# EAGLE board eTapper1main32 (EAGLE 8.3.2)
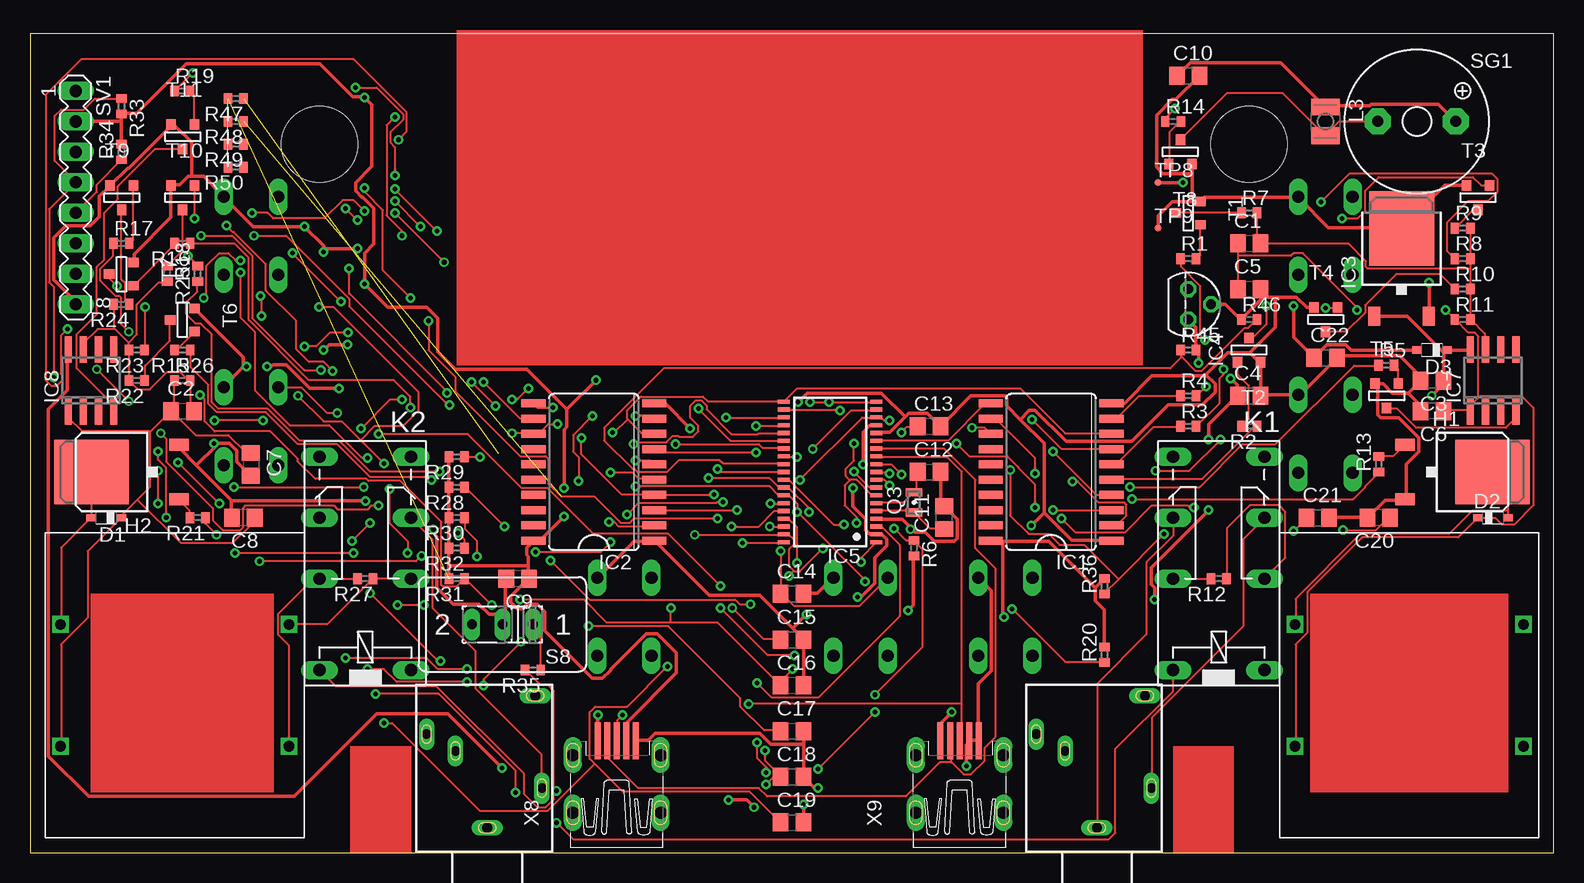
[diagram p1: board, top side]
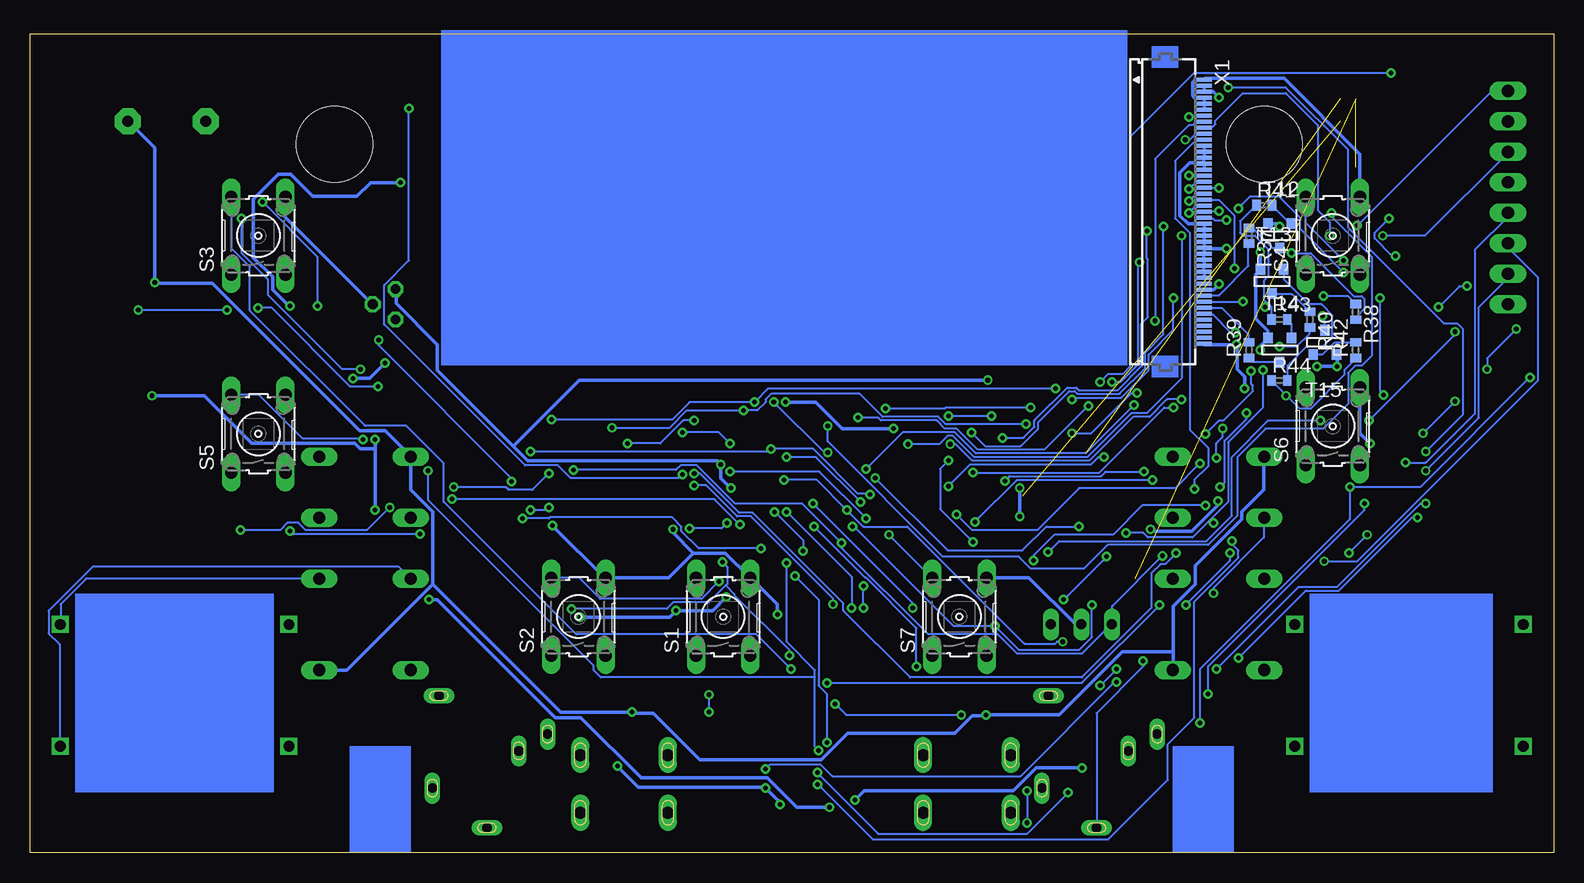
[diagram p2: board, bottom side, seen from below]

Size 126.98 x 68.25 mm. Coordinates in mm from the lower left corner, seen from the top.
Outline: 0,0 126.98,0 126.98,68.25 0,68.25 0,0
Copper layers (1*16): Top 0.035mm / dielectric 1.5mm / Bottom 0.035mm
Design rules "default *": minimum track width 6mil, minimum drill 15mil, track to track 6mil, track to pad 6mil, pad to pad 6mil, via to via 6mil, smd to smd 6mil, copper to edge 40mil, drill to drill 6mil, minimum pad ring 10mil, minimum via ring 8mil, stop-mask expansion 4mil, vias tented up to drill 0mil, thermal gap 10mil
Net classes: 1 GND: width 0.305 mm, clearance 0.152 mm; 2 BAT+: width 0.305 mm, clearance 0.152 mm; 3 +9V: width 0.305 mm, clearance 0.152 mm; 4 +3V: width 0.305 mm, clearance 0.152 mm; 5 VCC: width 0.305 mm, clearance 0.152 mm
Holes 6.35 mm at 24.13,59.05 101.6,59.05

## Footprints (pad centres in the part's own frame; a part is rotated, then mirrored left to right if it is on the bottom)
C0805 = smd 1.3 x 1.5: 1 -0.95,0; 2 0.95,0
SOD323_ST = smd 0.8 x 0.6: A 1.25,0; C -1.25,0
XFMR = drill 0.889 square: P$1 -10.16,5.08; P$2 -10.16,-5.08; P$3 8.89,5.08; P$4 8.89,-5.08
D-PAK_TO252AA = smd 1 x 1.6: 1 -2.28,-4.8; 3 2.28,-4.8 | smd 5.4 x 6.2: 4 0,2.5
SO20W = smd 0.66 x 2.032: 1 -5.715,-5.029; 2 -4.445,-5.029; 3 -3.175,-5.029; 4 -1.905,-5.029; 5 -0.635,-5.029; 6 0.635,-5.029; 7 1.905,-5.029; 8 3.175,-5.029; 9 4.445,-5.029; 10 5.715,-5.029; 11 5.715,5.029; 12 4.445,5.029; 13 3.175,5.029; 14 1.905,5.029; 15 0.635,5.029; 16 -0.635,5.029; 17 -1.905,5.029; 18 -3.175,5.029; 19 -4.445,5.029; 20 -5.715,5.029
TO252 = smd 1 x 1.6: 1 -2.28,-4.8; 3 2.28,-4.8 | smd 5.4 x 6.2: 2 0,2.5
TO92 = drill 0.813 pad 1.27 octagon: 1 -1.27,0; 2 0,1.905; 3 1.27,0
TSSOP38_R-PDSO-G38-DA = smd 0.35 x 1: 1 -5.85,-3.85; 2 -5.2,-3.85; 3 -4.55,-3.85; 4 -3.9,-3.85; 5 -3.25,-3.85; 6 -2.6,-3.85; 7 -1.95,-3.85; 8 -1.3,-3.85; 9 -0.65,-3.85; 10 0,-3.85; 11 0.65,-3.85; 12 1.3,-3.85; 13 1.95,-3.85; 14 2.6,-3.85; 15 3.25,-3.85; 16 3.9,-3.85; 17 4.55,-3.85; 18 5.2,-3.85; 19 5.85,-3.85; 20 5.85,3.85; 21 5.2,3.85; 22 4.55,3.85; 23 3.9,3.85; 24 3.25,3.85; 25 2.6,3.85; 26 1.95,3.85; 27 1.3,3.85; 28 0.65,3.85; 29 0,3.85; 30 -0.65,3.85; 31 -1.3,3.85; 32 -1.95,3.85; 33 -2.6,3.85; 34 -3.25,3.85; 35 -3.9,3.85; 36 -4.55,3.85; 37 -5.2,3.85; 38 -5.85,3.85
SO08 = smd 0.6 x 2.2: 1 -1.905,-2.6; 2 -0.635,-2.6; 3 0.635,-2.6; 4 1.905,-2.6; 5 1.905,2.6; 6 0.635,2.6; 7 -0.635,2.6; 8 -1.905,2.6
351 = drill 1.016 long: 1 -3.81,-3.81; 16 -3.81,3.81; O1 8.89,-3.81; O2 8.89,3.81; P1 3.81,-3.81; P2 3.81,3.81; S1 13.97,-3.81; S2 13.97,3.81
L2825P = smd 1.4 x 2.4: 1 -1.2,0; 2 1.2,0
FC-12M = smd 0.7 x 1.4: 1 -0.85,0; 2 0.85,0
R0402 = smd 0.7 x 0.9: 1 -0.65,0; 2 0.65,0
B3F-10XX = drill 1.016 long: 1 -3.251,2.261; 2 3.251,2.261; 3 -3.251,-2.261; 4 3.251,-2.261
M251 = drill 0.813 long: 1 -2.54,0; 2 0,0; 3 2.54,0
F/QMBIII = drill 0.914 pad 2.159 octagon: + 3.251,0; - -3.251,0
MA08-1 = drill 1.016 long: 1 -8.89,0; 2 -6.35,0; 3 -3.81,0; 4 -1.27,0; 5 1.27,0; 6 3.81,0; 7 6.35,0; 8 8.89,0
SOT-23 = smd 0.787 x 0.889: 1 0.025,-1.016; 2 -0.94,1.016; 3 0.991,1.016
TP06R = smd 0.6 x 0.6: TP 0,0
FH12-45S-0.5SH = smd 0.3 x 1.3: 1 -13,3.25; 2 -12.5,3.25; 3 -12,3.25; 4 -11.5,3.25; 5 -11,3.25; 6 -10.5,3.25; 7 -10,3.25; 8 -9.5,3.25; 9 -9,3.25; 10 -8.5,3.25; 11 -8,3.25; 12 -7.5,3.25; 13 -7,3.25; 14 -6.5,3.25; 15 -6,3.25; 16 -5.5,3.25; 17 -5,3.25; 18 -4.5,3.25; 19 -4,3.25; 20 -3.5,3.25; 21 -3,3.25; 22 -2.5,3.25; 23 -2,3.25; 24 -1.5,3.25; 25 -1,3.25; 26 -0.5,3.25; 27 0,3.25; 28 0.5,3.25; 29 1,3.25; 30 1.5,3.25; 31 2,3.25; 32 2.5,3.25; 33 3,3.25; 34 3.5,3.25; 35 4,3.25; 36 4.5,3.25; 37 5,3.25; 38 5.5,3.25; 39 6,3.25; 40 6.5,3.25; 41 7,3.25; 42 7.5,3.25; 43 8,3.25; 44 8.5,3.25; 45 9,3.25
1503_09 = drill 0.8 pad 1.2 long: 1 0,-2.1; 2 -4.55,-5.4; 3 5.05,-9.9; 4 -4,-13.1; 5 2.65,-8.5
32005-501 = smd 3.1 x 0.5: 1 3,1.6; 2 3,0.8; 3 3,0; 4 3,-0.8; 5 3,-1.6 | drill 1 pad 1.422 long: M1 -3,3.65; M2 -3,-3.65; M3 1.8,3.65; M4 1.8,-3.65

## Placement (x,y rotation side)
C1  .01uF  [C0805]  101.6,50.8 0 top
C2  .01uF  [C0805]  12.7,36.83 0 top
C3  [C0805]  116.84,39.37 180 top
C4  [C0805]  101.6,38.1 0 top
C5  3.3uF  [C0805]  101.6,46.99 0 top
C6  220uF  [C0805]  116.84,36.83 180 top
C7  220uF  [C0805]  18.41,32.38 270 top
C8  3.3uF  [C0805]  17.78,27.94 180 top
C9  47uF  [C0805]  40.64,22.86 180 top
C10  47uF  [C0805]  96.52,64.77 0 top
C11  12pF  [C0805]  76.2,27.94 90 top
C12  12pF  [C0805]  74.93,31.75 0 top
C13  1 uF  [C0805]  74.93,35.56 0 top
C14  .1uF  [C0805]  63.5,21.59 0 top
C15  .1uF  [C0805]  63.5,17.78 0 top
C16  .1uF  [C0805]  63.5,13.97 0 top
C17  .1uF  [C0805]  63.5,10.16 0 top
C18  .1uF  [C0805]  63.5,6.35 0 top
C19  .1uF  [C0805]  63.5,2.54 0 top
C20  .1uF  [C0805]  112.39,27.94 180 top
C21  .1uF  [C0805]  107.31,27.94 0 top
C22  220uF  [C0805]  107.95,41.27 0 top
D1  BAT60J  [SOD323_ST]  6.35,27.94 180 top
D2  BAT60J  [SOD323_ST]  121.92,27.94 0 top
D3  BAT60J  [SOD323_ST]  116.84,41.91 180 top
F1  XFMR  [XFMR]  115.57,13.97 0 top
F2  XFMR  [XFMR]  12.7,13.97 0 top
H1  IRLR024N  [D-PAK_TO252AA]  119.38,31.75 270 top
H2  IRLR024N  [D-PAK_TO252AA]  7.62,31.75 90 top
IC1  74AC373DW  [SO20W]  85.09,31.75 90 top
IC2  74AC373DW  [SO20W]  46.99,31.75 90 top
IC3  LM2936DT-5.0  [TO252]  114.3,49.53 0 top
IC4  LM2936Z-3.0  [TO92]  96.52,45.72 270 top
IC5  MSP430F2232IDA  [TSSOP38_R-PDSO-G38-DA]  66.67,31.75 90 top
IC7  LP2951M  [SO08]  121.92,39.37 0 top
IC8  LP2951M  [SO08]  5.08,39.37 0 top
K1  351  [351]  99.06,19.05 90 top
K2  351  [351]  27.94,19.05 90 top
L3  470uH  [L2825P]  107.95,60.96 270 top
Q3  FC-12M  [FC-12M]  73.66,29.21 90 top
R1  47K  [R0402]  96.52,49.53 0 top
R2  47K  [R0402]  101.6,35.56 180 top
R3  47K  [R0402]  96.52,35.56 0 top
R4  47K  [R0402]  96.52,38.1 0 top
R5  47K  [R0402]  113.03,40.64 0 top
R6  47K  [R0402]  73.66,25.4 270 top
R7  1K  [R0402]  101.6,53.34 0 top
R8  3K  [R0402]  119.38,49.53 0 top
R9  6K  [R0402]  119.38,52.07 0 top
R10  12K  [R0402]  119.38,46.99 0 top
R11  3K  [R0402]  119.38,44.45 0 top
R12  51K  [R0402]  99.06,22.86 180 top
R13  1K  [R0402]  112.39,32.38 90 top
R14  1K  [R0402]  95.25,60.96 0 top
R15  47K  [R0402]  12.7,41.91 180 top
R16  47K  [R0402]  12.7,50.8 180 top
R17  47K  [R0402]  7.62,50.8 0 top
R18  47K  [R0402]  13.97,48.26 90 top
R19  47K  [R0402]  12.7,63.5 0 top
R20  47K  [R0402]  89.53,16.51 90 top
R21  1K  [R0402]  13.97,27.94 180 top
R22  1K  [R0402]  8.89,39.37 180 top
R23  3K  [R0402]  8.89,41.91 180 top
R24  6K  [R0402]  7.62,45.72 180 top
R25  12K  [R0402]  11.43,48.26 270 top
R26  3K  [R0402]  12.7,39.37 0 top
R27  51K  [R0402]  27.94,22.86 180 top
R28  47K  [R0402]  35.56,30.48 180 top
R29  47K  [R0402]  35.56,33.02 180 top
R30  47K  [R0402]  35.56,27.94 180 top
R31  47K  [R0402]  35.56,22.86 180 top
R32  47K  [R0402]  35.56,25.4 180 top
R33  47K  [R0402]  7.62,62.23 270 top
R34  47K  [R0402]  7.62,58.42 90 top
R35  100  [R0402]  41.91,15.24 180 top
R36  47K  [R0402]  89.53,22.23 90 top
R37  100  [R0402]  25.4,51.44 270 bottom
R38  100  [R0402]  16.51,45.09 270 bottom
R39  100  [R0402]  25.4,41.91 90 bottom
R40  100  [R0402]  20.32,44.45 270 bottom
R41  47K  [R0402]  24.13,53.98 0 bottom
R42  47K  [R0402]  16.51,41.91 90 bottom
R43  47K  [R0402]  22.86,44.45 0 bottom
R44  47K  [R0402]  22.86,39.37 0 bottom
R45  47K  [R0402]  96.52,41.91 0 top
R46  10K  [R0402]  101.6,44.45 0 top
R47  47K  [R0402]  17.14,62.87 180 top
R48  47K  [R0402]  17.14,60.96 180 top
R49  47K  [R0402]  17.14,59.05 180 top
R50  47K  [R0402]  17.14,57.15 180 top
S1  [B3F-10XX]  69.22,19.68 90 bottom
S2  [B3F-10XX]  81.28,19.68 90 bottom
S3  [B3F-10XX]  107.95,51.44 90 bottom
S4  [B3F-10XX]  18.41,51.44 90 bottom
S5  [B3F-10XX]  107.95,34.92 90 bottom
S6  [B3F-10XX]  18.41,35.56 90 bottom
S7  [B3F-10XX]  49.53,19.68 90 bottom
S8  [M251]  39.37,19.05 180 top
SG1  F/QMBIII  [F/QMBIII]  115.57,60.96 0 top
SV1  100mil  [MA08-1]  3.81,54.61 270 top
T1  2N3904  [SOT-23]  96.52,53.34 270 top
T2  2N3904  [SOT-23]  101.6,41.91 180 top
T3  2N3904  [SOT-23]  120.65,54.61 0 top
T4  2N3904  [SOT-23]  107.95,44.45 0 top
T5  2N3904  [SOT-23]  113.03,38.1 0 top
T6  2N3904  [SOT-23]  12.7,44.45 270 top
T7  2N3904  [SOT-23]  7.62,48.26 270 top
T8  2N3904  [SOT-23]  95.89,58.42 180 top
T9  2N3904  [SOT-23]  7.62,54.61 0 top
T10  2N3904  [SOT-23]  12.7,54.61 0 top
T11  2N3904  [SOT-23]  12.7,59.69 0 top
T12  2N3904  [SOT-23]  22.86,51.44 0 bottom
T13  2N3904  [SOT-23]  23.5,47.62 0 bottom
T14  2N3904  [SOT-23]  22.86,41.91 0 bottom
T15  2N3904  [SOT-23]  19.05,42.55 180 bottom
TP8  TPSTP06R  [TP06R]  93.98,55.88 0 top
TP9  TPSTP06R  [TP06R]  93.98,52.07 0 top
X1  FH12-45S-0.5SH  [FH12-45S-0.5SH]  32.38,51.44 270 bottom
X6  1503_09  [1503_09]  88.9,0 180 top
X7  1503_09  [1503_09]  38.1,0 180 top
X8  MINI-USB_SHIELD5P4-32005-501  [32005-501]  48.9,6.35 90 top
X9  MINI-USB_SHIELD5P4-32005-501  [32005-501]  77.47,6.35 90 top

## Tracks (layer width: path | path; a pad name or v marks a point on that pad's centre or on a via)
+3V  (via drill 0.38)  (4 unrouted)
  Top 0.305: R20.2 89.53,20.27 88.77,21.03 88.77,22.1 | 88.77,22.1 89.53,22.86 R36.2 | 81.08,25.98 84.89,25.98 88.77,22.1 | 81.08,25.98 80.09,25.98 IC1.20 | v73.15,20.19 73.61,20.65 73.61,24.69 R6.2 | v68.96,21.34 69.27,21.34 70.41,22.48 70.41,24.61 71.4,25.6 71.4,26.14 71.02,26.52 70.56,26.52 IC5.2 70.41,26.59 69.95,26.59 69.65,26.9 69.65,27.81 68.58,28.88 v68.58,30.4 | v69.42,32.38 69.42,35.05 69.95,35.59 70.48,35.59 IC5.16 | 81.08,25.98 81.08,19.74 v81.15,19.66 | 41.53,23.93 41.53,24.69 41.38,24.84 41.38,25.45 IC2.20 42.06,26.14 42.6,26.14 v44.5,28.04 | 41.53,23.93 41.53,22.86 C9.1 41.45,22.78 40.08,21.41 40.08,20.88 40.62,20.34 41.07,20.34 41.45,20.73 42.29,20.73 42.9,20.12 42.9,18.52 46.86,14.55 47.7,14.55 48.39,15.24 48.39,15.32 51.36,18.29 52.27,18.29 53.87,16.69 53.87,15.01 49.76,10.9 49.76,9.37 X8.4 | 34.9,23.93 34.9,25.38 R32.2 34.9,25.53 34.9,27.89 R30.2 34.9,28.04 R28.2 34.9,30.56 34.9,32.99 R29.2 | 34.9,23.93 R31.2 | 34.9,23.93 41.53,23.93 | 7.62,60.96 R33.2 7.7,61.65 8.91,61.65 13.03,65.76 24.16,65.76 26.9,63.02 27.81,63.02 v27.89,62.94 28.5,62.33 28.5,57.23 27.13,55.85 27.13,55.17 27.66,54.63 27.74,54.63 28.65,53.72 28.65,50.75 27.89,49.99 v27.89,47.4 29.79,45.49 33.07,45.49 33.98,44.58 33.98,41.76 35.43,40.31 41.38,40.31 44.73,36.96 | 7.62,60.96 R34.2 | SV1.2 7.62,60.96 | v44.5,30.4 44.5,35.28 44.73,35.51 44.73,36.96 | 44.73,36.96 v47.17,39.4
  Bottom 0.305: v68.96,21.34 70.1,20.19 v73.15,20.19 73.69,19.66 v81.15,19.66 | v68.58,30.4 69.42,31.24 v69.42,32.38 69.72,32.69 85.5,32.69 86.72,33.91 | 86.72,33.91 93.04,40.23 93.04,42.37 96.47,45.8 96.47,46.94 IC4.1 | v27.89,47.4 28.35,46.94 29.11,46.94 X1.36 | v27.89,62.94 28.42,63.48 29.11,63.48 | 29.11,63.48 X1.3 | 29.11,63.48 29.11,63.93 X1.2 | v44.5,30.4 v44.5,28.04 | 86.72,33.91 81.23,39.4 v47.17,39.4
+9V  (via drill 0.38)
  Top 0.305: D3.C 120.02,41.91 IC7.8 | D3.C 117.96,41.83 117.81,41.68 117.81,39.4 C3.1 117.73,39.24 117.73,39.01 v116.81,38.1 | IC3.1 112.09,44.73 114.76,44.73 117.73,41.76 D3.C | IC4.3 97.16,43.81 97.16,41.91 R45.2 97.31,41.83 97.38,41.76 v97.38,40.84 | v100.05,39.55 100.58,39.01 100.58,38.1 C4.1 100.51,38.02 98.22,35.74 v98.22,34.44 | v39.32,7.09 34.82,11.58 28.88,11.58 22.02,4.72 4.88,4.72 1.52,8.08 1.52,36.96 3.12,38.56 3.12,41.91 IC8.8 | v58.22,4.42 59.74,4.42 v60.35,3.81 | v93.73,21.11 93.73,22.1 93.42,22.4 93.42,23.77 v98.22,28.57
  Bottom 0.305: v100.05,39.55 98.68,39.55 v97.38,40.84 | v39.32,7.09 43.13,7.09 45.03,5.18 57.45,5.18 v58.22,4.42 | v60.35,3.81 63.09,3.81 65.53,6.25 76.05,6.25 81.08,11.28 83.21,11.28 93.04,21.11 v93.73,21.11 | v98.22,34.44 98.22,33.68 | 98.22,33.68 v98.22,28.57 | v116.81,38.1 112.47,38.1 108.51,34.14 99.9,34.14 99.44,33.68 98.22,33.68
/LCS  (via drill 0.38)  (1 unrouted)
  Top 0.152: v68.66,31.77 69.95,30.48 70.48,30.48 IC5.8 | v57.3,27.89 50.37,27.89 49.99,27.51 49.23,27.51 47.02,29.72 44.27,29.72 43.2,30.79 43.2,32.84 42.98,33.07 40.84,33.07 35.43,38.48 35.43,39.7 33.22,41.91 v33.22,44.35
  Bottom 0.152: v68.66,31.77 61.19,31.77 v57.3,27.89 | v33.22,44.35 33.22,57.84 30.4,60.66 30.1,60.66 29.87,60.88 29.18,60.88 X1.8
/RST  (via drill 0.38)
  Top 0.152: v72.01,27.05 73,26.06 73.61,26.06 R6.1 73.69,25.98 74.37,25.3 74.37,17.14 v70.41,13.18 | v68.89,27.51 68.89,27.96 67.89,28.96 67.89,30.63 68.31,31.05 | 68.31,31.05 68.35,31.09 68.89,31.09 70.1,29.87 70.48,29.87 IC5.7 | v72.62,35.05 73.08,35.51 73.91,35.51 C13.1 | v68.66,34.14 68.66,32.69 67.97,32 67.97,31.39 68.31,31.05 | v10.67,29.11 v10.67,31.85 | v28.12,15.32 29.49,15.32 30.56,14.25 v36.42,14.25 | v70.41,11.73 v65.68,7.01
  Bottom 0.152: v72.01,27.05 69.34,27.05 v68.89,27.51 | v72.62,35.05 69.57,35.05 v68.66,34.14 | SV1.7 3.81,47.93 6.25,45.49 6.25,36.27 v10.67,31.85 | v10.67,29.11 11.12,29.11 18.06,22.17 21.26,22.17 v28.12,15.32 | v36.42,14.25 36.58,14.25 44.42,6.4 60.12,6.4 61.11,7.39 65.3,7.39 v65.68,7.01 | v70.41,13.18 v70.41,11.73
BAT+  (via drill 0.38)
  Top 0.305: v96.09,55.85 94.03,55.85 TP8.TP | v105.31,45.57 105.31,42.98 106.98,41.3 C22.1 107.06,41.38 108.05,42.37 109.65,42.37 110.11,41.91 D3.A
  Bottom 0.305: v96.09,55.85 98.6,55.85 99.75,54.71 103.4,54.71 105.23,56.54 106.3,56.54 108.36,54.48 108.36,49.61 106.76,48.01 106.76,46.94 105.39,45.57 v105.31,45.57
GND  (via drill 0.38)
  Top 0.305: 72.92,36.35 73.23,36.65 74.75,36.65 75.82,35.59 C13.2 75.97,35.66 78.41,38.1 81.23,38.1 81.38,37.95 81.38,37.26 82.53,36.12 | 72.92,36.35 71.63,35.05 70.56,35.05 IC5.15 | 84.51,28.35 86.79,26.06 90.07,26.06 IC1.1 | 84.51,28.35 84.51,34.14 82.53,36.12 | v55.02,35.36 52.96,37.41 52.05,37.41 IC2.10 | v64.01,37.57 64.77,38.33 70.94,38.33 72.92,36.35 | T3.2 117.88,55.63 114.3,52.05 IC3.2 114.22,52.12 108.2,52.12 105.77,54.56 S3.4 105.69,54.63 97.84,54.63 97.61,54.41 T1.2 97.54,54.25 96.85,54.25 | 96.85,54.25 95.17,54.25 94.03,53.11 94.03,52.12 TP9.TP | 96.85,54.25 96.85,56.62 | 96.85,56.62 96.85,57.38 T8.2 | 96.85,56.62 94.41,56.62 93.88,57.15 93.88,61.49 95.17,62.79 95.48,62.79 C10.2 | C21.2 108.28,27.96 111.4,27.96 C20.2 111.56,28.04 112.93,29.41 114.53,29.41 H1.3 114.68,29.57 114.68,32.38 115.75,33.45 115.75,34.59 114.07,36.27 112.55,36.27 112.32,36.5 112.32,39.01 T5.2 112.09,39.09 112.78,39.09 113.54,38.33 114.83,38.33 | 114.83,38.33 115.82,39.32 C3.2 115.82,39.47 115.82,39.78 114.15,41.45 109.19,41.45 109.04,41.3 C22.2 108.89,41.22 105.84,38.18 S5.4 102.64,38.18 C4.2 102.56,38.1 102.56,40.84 T2.2 102.41,40.92 101.65,41.68 | 114.83,38.33 115.82,37.34 115.82,36.88 C6.2 | 103.78,46.33 103.17,46.33 102.56,46.94 C5.2 102.95,46.48 100.97,44.5 R46.1 100.81,44.5 99.59,45.72 IC4.2 | 103.78,46.33 105.54,46.33 106.38,45.49 106.98,45.49 T4.2 | 97.99,39.85 99.82,41.68 101.65,41.68 | 97.99,39.85 97.92,39.78 93.5,39.78 91.21,37.49 90.14,37.49 IC1.10 | 103.78,46.33 103.78,43.81 101.65,41.68 | 82.53,36.12 83.29,36.88 83.74,36.88 86.33,34.29 91.82,34.29 94.87,37.34 97.69,37.34 98.75,38.41 98.75,39.09 97.99,39.85
  Top 0.305: SV1.8 3.81,45.95 1.98,47.78 1.98,51.28 2.97,52.27 5.03,52.27 5.79,53.03 5.79,54.71 6.63,55.55 T9.2 6.71,55.63 8.15,57.07 8.23,57.07 11.81,60.66 T11.2 11.89,60.58 12.12,60.58 13.49,59.21 13.49,56.39 | S6.4 16.15,38.86 17.83,40.54 v18.06,40.54 17.75,40.62 17.75,41.3 13.72,45.34 T6.2 | 16.76,29.34 16.76,29.41 13.87,32.31 | 16.76,29.34 16.76,27.96 C8.2 | 13.87,32.31 12.42,33.76 12.42,33.98 H2.3 | 13.87,32.31 15.51,33.95 | 15.51,33.95 15.7,34.14 16.61,34.14 17.22,33.53 17.22,32.61 18.36,31.47 C7.2 | 15.51,33.95 v15.32,34.14 | v26.44,42.37 24.92,42.37 v24.46,41.91 | T7.2 8.69,49.23 8.69,49.91 11.73,52.96 11.73,55.63 T10.2 11.89,55.7 12.5,55.7 13.18,56.39 13.49,56.39 | 13.49,56.39 14.48,56.39 16.08,54.79 S4.4 16.15,54.63 18.59,52.2 v22.86,52.2 24.46,50.6 v24.46,50.06 24.54,50.37 v27.28,50.37 | v19.74,40.54 20.12,40.54 20.27,40.69 21.34,40.69 23.32,38.71 v25.76,38.71 | C9.2 39.62,22.86 39.62,19.28 39.4,19.05 S8.2 39.55,19.89 38.25,19.89 37.41,20.73 35.28,20.73 33.91,22.1 33.91,26.36 33.6,26.67 v33.6,26.98 | C16.2 64.47,14.02 64.47,17.75 C15.2 64.39,17.91 63.55,18.75 | S7.4 47.32,22.94 50.37,25.98 51.97,25.98 IC2.1 52.12,25.98 56.62,21.49 60.81,21.49 63.55,18.75 | v64.47,4.04 64.47,2.59 C19.2 | v65.68,5.41 65.38,5.41 64.47,6.33 C18.2 64.47,6.48 64.47,9.07 | 64.47,9.07 64.47,10.13 C17.2 | 64.47,9.07 61.72,9.07 60.81,9.98 52.12,9.98 51.51,9.37 50.52,9.37 X8.5 | 73.46,27.05 73.76,26.75 74.6,26.75 75.36,25.98 77.04,25.98 77.27,26.21 77.27,27.81 C11.2 76.2,29.03 75.89,29.34 75.89,31.7 C12.2 | 73.46,27.05 72.69,27.81 70.56,27.81 IC5.4 | C14.2 64.47,21.64 65.61,21.64 66.9,22.94 S1.4
  Top 0.305: S2.4 80.09,21.87 80.09,15.16 79.02,14.1 79.02,9.53 X9.5 79.02,9.37 78.33,9.37 X9.4 78.26,9.22 78.03,8.99 v78.03,7.24 | v73.38,26.98 73.46,27.05 | v64.69,19.89 63.55,18.75 | v27.96,29.34 16.76,29.34 | v83.44,27.28 84.51,28.35
  Bottom 0.305: v55.02,35.36 59.28,35.36 61.49,37.57 v64.01,37.57 | S3.4 105.69,52.96 98.45,45.72 IC4.2 | T15.2 18.06,41.53 v18.06,40.54 v19.74,40.54 | S6.4 16.15,34.98 v15.32,34.14 | X1.16 29.11,57 29.11,57.38 X1.15 | X1.12 29.11,58.9 29.11,58.52 X1.13 29.11,58.37 29.11,57.99 X1.14 29.18,57.84 29.18,57.53 X1.15 | X1.34 29.11,48.01 29.11,48.39 X1.33 29.18,48.54 29.18,48.84 X1.32 29.11,49 29.11,49.38 X1.31 29.18,49.53 29.18,49.84 X1.30 29.11,49.99 29.11,50.37 X1.29 | X1.29 29.11,50.52 29.11,50.9 X1.28 29.11,51.05 29.11,51.44 X1.27 29.11,51.51 29.11,51.89 X1.26 29.11,52.05 29.11,52.43 X1.25 29.26,52.43 30.48,52.43 31.17,53.11 31.17,56.69 30.33,57.53 29.34,57.53 X1.15 | v24.46,41.91 24.46,42.22 23.85,42.82 T14.2 23.85,42.98 23.85,43.51 24.84,44.5 24.84,48.23 T13.2 24.46,48.77 v24.46,50.06 | X1.45 29.11,42.37 v26.44,42.37 26.36,42.29 26.36,40.31 25.76,39.7 v25.76,38.71 | X1.6 29.11,61.95 29.11,62.41 X1.5 29.11,62.56 29.11,62.87 X1.4 29.26,62.94 29.95,62.94 30.1,63.09 30.1,64.24 29.87,64.47 29.18,64.47 X1.1 29.03,64.54 22.48,64.54 16.15,58.22 S4.4 | v22.86,52.2 23.09,52.43 23.77,52.43 T12.2 | v27.28,50.37 28.96,50.37 X1.29 | S8.2 39.85,19.05 43.74,22.94 S7.4 | v64.47,4.04 64.47,4.19 v65.68,5.41 65.76,5.49 76.28,5.49 v78.03,7.24 | 71.7,24.99 73.76,22.94 S2.4 79.1,22.94 v83.44,27.28 | 71.7,24.99 69.04,24.99 66.98,22.94 S1.4 66.83,22.86 64.69,20.73 v64.69,19.89 | v73.38,26.98 73.38,26.67 71.7,24.99 | v27.96,29.34 27.96,29.03 30.18,26.82 33.45,26.82 v33.6,26.98
IO1_0  (via drill 0.38)
  Top 0.152: S1.2 69.11,20.57 63.7,20.57 62.71,21.57 62.56,21.57 C14.1 62.56,21.64 v62.56,25.15 | v39.55,27.2 36.27,30.48 R28.1 | v56.54,31.24 61.65,31.24 62.41,30.48 62.79,30.48 IC5.31 62.87,30.4 63.25,30.4 64.92,28.73 v64.92,28.42
  Bottom 0.152: v39.55,27.2 42.29,27.2 44.27,25.22 50.52,25.22 v56.54,31.24 | v62.56,25.15 62.56,26.06 v64.92,28.42
IO1_1  (via drill 0.38)
  Top 0.152: v37.49,32.99 36.27,32.99 R29.1 | v50.44,30.56 61.65,30.56 62.33,29.87 62.79,29.87 IC5.32 62.87,29.79 63.25,29.79 63.93,29.11 v63.93,28.42 69.57,22.78 v69.57,22.63 | v58.52,20.42 61.11,17.83 62.48,17.83 C15.1
  Bottom 0.152: v37.49,32.99 37.95,32.99 38.56,32.38 48.62,32.38 v50.44,30.56 | v58.52,20.42 58.52,23.01 v63.93,28.42 | S2.2 81.23,22.94 79.48,21.18 71.02,21.18 v69.57,22.63
IO1_2  (via drill 0.38)
  Top 0.152: v37.26,24.69 37.26,25.98 36.27,26.98 36.27,27.89 R30.1 | v40.84,21.11 46.18,21.11 48.08,19.2 53.42,19.2 | 53.42,19.2 57.3,19.2 62.48,14.02 C16.1 62.41,14.17 v63.55,15.32 | v61.72,29.11 62.79,29.11 IC5.33 | 53.42,19.2 v53.42,20.42
  Bottom 0.152: v40.84,21.11 v37.26,24.69 | v61.72,29.11 53.42,20.8 v53.42,20.42 | v63.55,15.32 66.45,18.21 81.46,18.21 92.51,29.26 92.51,32.46 95.63,35.59 99.06,35.59 108.66,45.19 108.66,48.84 110.19,50.37 110.19,54.63 S3.2
IO1_3  (via drill 0.38)
  Top 0.152: v38.48,20.65 36.27,22.86 R31.1 36.2,22.86 35.51,22.17 34.44,22.17 34.29,22.33 34.29,27.58 30.86,31.01 28.19,31.01 28.04,31.17 23.77,31.17 22.33,32.61 22.33,32.84 20.04,35.13 15.39,35.13 14.55,35.97 14.55,37.8 v14.17,38.18 | v46.56,18.9 53.19,18.9 59.21,12.88 59.21,12.19 61.19,10.21 62.48,10.21 C17.1 | v58.45,27.2 60.73,27.2 62.03,28.5 62.79,28.5 IC5.34 | v17.53,49.38 17.14,49.38 16.54,49.99 15.77,49.99 14.71,48.92 14.71,46.48 v14.48,46.25
  Bottom 0.152: v38.48,20.65 38.48,17.98 39.55,16.92 44.58,16.92 v46.56,18.9 49.99,18.9 58.29,27.2 v58.45,27.2 | v17.53,49.38 20.65,52.5 20.65,54.63 S4.2 | v14.48,46.25 14.48,38.48 v14.17,38.18
IO4_0  (via drill 0.38)
  Top 0.152: v64.16,31.09 69.34,36.27 70.48,36.27 IC5.17 70.56,36.27 70.94,36.27 71.17,36.04 v71.63,36.04 | IC2.3 v58.9,28.57 | v30.4,56.46 30.4,58.83 30.02,59.21 30.02,60.05 31.09,61.11 31.09,61.57 28.88,63.78 v27.13,63.78 | v10.67,33.45 10.67,32.77 11.35,32.08 v11.35,27.96 | v26.29,16.23 33.07,16.23 33.98,15.32 v36.42,15.32 | v37.8,13.95 37.8,14.48 v40.92,17.6 | v85.27,28.57 IC1.3 | v83.74,28.8 83.74,30.71 82.37,32.08 82.37,32.16 81.46,33.07 78.26,33.07 v77.19,34.14
  Bottom 0.152: v64.16,31.09 61.42,31.09 v58.9,28.57 57.53,27.2 53.87,27.2 44.12,17.45 41.53,17.45 41.38,17.6 v40.92,17.6 | v30.4,56.46 29.18,56.46 X1.17 | v27.13,63.78 22.33,63.78 17.14,58.6 17.14,52.12 9.14,44.12 8,44.12 7.54,43.66 7.54,36.58 v10.67,33.45 | v11.35,27.96 11.81,27.96 17.91,21.87 20.65,21.87 v26.29,16.23 | v37.8,13.95 v36.42,15.32 | v85.27,28.57 83.97,28.57 v83.74,28.8 | v77.19,34.14 74.45,34.14 72.54,36.04 v71.63,36.04
IO4_1  (via drill 0.38)
  Top 0.152: v65.23,33.68 68.43,36.88 70.48,36.88 IC5.18 | v57,29.87 52.05,29.87 IC2.4 51.97,29.87 49.3,29.87 45.95,33.22 v45.95,34.59 | v33.91,51.82 v30.4,55.32 | v85.27,33.45 88.85,29.87 90.07,29.87 IC1.4
  Bottom 0.152: v57,29.87 57.07,29.95 57.99,29.95 61.72,33.68 v65.23,33.68 65.46,33.45 v85.27,33.45 | v30.4,55.32 29.79,55.93 29.18,55.93 X1.18 | v33.91,51.82 33.91,49.53 33.83,49.45 33.83,44.65 34.37,44.12 34.37,40.54 36.35,38.56 39.55,38.56 39.78,38.79 40.54,38.79 43.28,36.04 43.28,35.51 44.2,34.59 v45.95,34.59
IO4_2  (via drill 0.38)
  Top 0.152: v65,37.57 v66.6,37.57 70.48,37.57 IC5.19 | v60.5,33.38 52.27,33.38 52.05,33.6 IC2.7 | v27.89,55.4 27.89,55.09 29.41,53.57 29.41,48.54 v31.7,46.25 | v40.16,37.8 40.62,37.8 v41.53,38.71 | v83.52,36.12 85.95,33.68 90.07,33.68 IC1.7
  Bottom 0.152: v65,37.57 60.81,33.38 v60.5,33.38 | v27.89,55.4 29.11,55.4 X1.19 | v31.7,46.25 31.7,43.59 33.76,41.53 33.76,40.23 36.04,37.95 40.01,37.95 v40.16,37.8 | v41.53,38.71 65.46,38.71 v66.6,37.57 72.01,37.57 73.46,36.12 v83.52,36.12
IO4_3  (via drill 0.38)
  Top 0.152: 49.8,36.16 50.98,34.98 51.97,34.98 IC2.8 | 49.8,36.16 49.76,36.2 49.76,36.88 50.9,38.02 56.08,38.02 56.46,37.64 62.79,37.64 IC5.20 62.87,37.64 63.93,38.71 82.53,38.71 86.26,34.98 90.07,34.98 IC1.8 | v32.54,52.2 v30.4,54.33 | v48.54,35.05 48.69,35.05 49.8,36.16
  Bottom 0.152: v30.4,54.33 29.87,54.86 29.18,54.86 X1.20 | v32.54,52.2 32.54,43.2 34.06,41.68 34.06,40.39 36.2,38.25 39.7,38.25 39.93,38.48 40.39,38.48 42.98,35.89 42.98,35.36 44.42,33.91 47.4,33.91 v48.54,35.05
IO4_4  (via drill 0.38)
  Top 0.152: v67.51,36.88 62.87,36.88 IC5.21 | v78.49,35.43 79.55,35.43 IC1.13 | v26.59,48.69 26.59,46.63 34.75,38.48 v34.75,38.33 | v40.16,34.98 41.91,34.98 IC2.13 41.99,34.98 42.44,34.98 43.2,35.74 v43.97,35.74
  Bottom 0.152: v78.49,35.43 73.69,35.43 72.24,36.88 v67.51,36.88 66.37,36.88 65.68,37.57 65.68,37.8 65.23,38.25 57.84,38.25 55.93,36.35 51.28,36.35 50.67,35.74 v43.97,35.74 | v26.59,48.69 26.59,53.11 27.89,54.41 29.11,54.41 X1.21 | v34.75,38.33 35.2,38.33 38.56,34.98 v40.16,34.98
IO4_5  (via drill 0.38)
  Top 0.152: v57.99,36.27 62.79,36.27 IC5.22 | v36.8,39.24 v38.79,37.26 | v30.4,53.34 v34.52,49.23
  Bottom 0.152: v57.99,36.27 56.31,36.27 56.08,36.04 51.44,36.04 50.75,35.36 49.76,35.36 48.01,33.6 42.44,33.6 v38.79,37.26 | v36.8,39.24 36.12,39.24 34.67,40.69 34.67,49.07 v34.52,49.23 | v30.4,53.34 29.87,53.87 29.18,53.87 X1.22
IO4_6  (via drill 0.38)
  Top 0.152: v60.5,35.59 62.79,35.59 IC5.23 | v18.52,53.34 19.81,53.34 20.27,52.88 24.54,52.88 26.06,54.41 26.98,54.41 v27.89,53.49
  Bottom 0.152: v60.5,35.59 60.5,34.29 50.9,24.69 44.58,24.69 43.59,23.7 39.17,23.7 37.19,25.68 28.8,25.68 26.36,28.12 26.36,32.99 24,35.36 19.2,35.36 17.14,37.41 17.14,40.01 16.54,40.62 16,40.62 15.16,41.45 15.16,49.68 18.52,53.03 v18.52,53.34 | v27.89,53.49 29.11,53.49 X1.23
IO4_7  (via drill 0.38)
  Top 0.152: v50.29,34.06 50.44,34.21 53.03,34.21 53.57,34.75 54.03,34.75 54.1,34.67 55.24,34.67 55.7,35.13 55.7,35.59 55.02,36.27 55.02,37.26 55.47,37.72 55.93,37.72 56.39,37.26 56.39,36.96 58.45,34.9 60.66,34.9 60.73,34.98 62.79,34.98 IC5.24 | v31.01,37.8 30.02,37.8 v27.58,35.36 | v28.12,32.92 27.66,32.92 24.92,35.66 21.64,35.66 18.75,38.56 18.75,43.43 17.53,44.65 v17.53,48.39 | v27.28,52.73 v26.29,53.72
  Bottom 0.152: v50.29,34.06 49.84,34.06 48.46,32.69 38.71,32.69 35.05,36.35 33.68,36.35 32.23,37.8 v31.01,37.8 | v27.58,35.36 27.58,34.67 28.12,34.14 v28.12,32.92 | v17.53,48.39 21.18,52.05 21.18,52.96 22.94,54.71 25.3,54.71 v26.29,53.72 | v27.28,52.73 28.27,52.73 28.42,52.88 29.11,52.88 X1.24
J2_1
  Top 0.152: K1.P1 104.62,24.61 104.62,28.42 104.09,28.96 101.65,28.96 99.75,27.05 99.75,22.86 R12.1
  Bottom 0.152: K1.P1 122.3,22.86 124.44,20.73 124.44,19.05 F1.P$3
J2_3
  Top 0.152: K1.P2 R12.2
  Bottom 0.152: K1.P2 96.24,23.85 121.77,23.85 125.42,20.19 125.42,18.29 124.51,17.37 124.51,8.91 F1.P$4
J3_1
  Top 0.152: K2.P1 R27.1 28.57,22.86 24.77,19.05 F2.P$3
J3_3
  Top 0.152: R27.2 K2.P2 23.62,22.86 20.65,19.89 20.65,18.21 21.57,17.3 21.57,8.91 F2.P$4
LD_/C  (via drill 0.38)  (1 unrouted)
  Top 0.152: v57.3,32 57.53,31.77 62.79,31.77 IC5.29 | v34.98,37.34 34.82,37.34 26.59,45.57 26.59,46.18 21.34,51.44 v18.67,51.44
  Bottom 0.152: v57.3,32 54.25,35.05 49.91,35.05 48.16,33.3 39.01,33.3 v34.98,37.34 | v18.67,51.44 18.67,52.58 19.66,53.57 19.66,60.66 22.33,63.32 25.91,63.32 28.19,61.04 28.19,60.73 28.42,60.5 29.11,60.5 X1.9
LEDK1
  Bottom 0.152: R37.2 25.45,50.75 25.45,48.92 27.89,46.48 29.11,46.48 X1.37
LEDK2  (via drill 0.38)
  Top 0.152: v25.91,45.95 v21.87,49.99
  Bottom 0.152: v21.87,49.99 20.27,49.99 16.69,46.41 16,46.41 15.77,46.18 15.77,45.34 16.46,44.65 16.46,44.5 R38.2 | v25.91,45.95 29.11,45.95 X1.38
LEDK3
  Bottom 0.152: R39.2 25.45,42.6 25.45,43.2 27.66,45.41 29.11,45.41 X1.39
LEDK4  (via drill 0.38)
  Top 0.152: v22.86,42.22 23.85,42.22 24.99,43.36 v26.52,43.36
  Bottom 0.152: v22.86,42.22 21.41,42.22 20.34,43.28 20.34,43.74 R40.2 | v26.52,43.36 26.9,43.36 28.42,44.88 29.11,44.88 X1.40
LHVTRIG  (via drill 0.38)
  Top 0.152: v91.82,29.49 110.26,29.49 111.25,30.48 111.25,30.56 112.39,31.7 R13.1 | v67.82,27.36 66.98,27.36 63.25,31.09 62.87,31.09 IC5.30
  Bottom 0.152: v91.82,29.49 69.95,29.49 v67.82,27.36
LLED  (via drill 0.38)
  Top 0.152: v63.93,32.99 62.87,32.99 IC5.27 | v57.76,29.26 57.3,29.26 57.23,29.18 50.75,29.18 v49.76,28.19 | 27.55,34.4 25.98,35.97 24.46,35.97 v22.33,38.1 | 27.55,34.4 v29.49,32.46 | v24.08,45.49 25.3,45.49 32.38,38.41 32.38,36.88 31.09,35.59 28.73,35.59 27.55,34.4
  Bottom 0.152: 23.81,45.76 24.16,46.1 24.16,47.7 23.77,48.08 23.77,50.29 24.92,51.44 25.91,51.44 26.14,51.66 26.14,52.65 24.84,53.95 R41.1 | 23.81,45.76 23.55,45.49 23.55,44.5 R43.1 | 22.29,38.14 21.18,37.03 20.27,37.03 17.45,39.85 17.45,40.23 16.46,41.22 R42.1 | 22.29,38.14 23.47,39.32 R44.1 | v63.93,32.99 61.49,32.99 v57.76,29.26 | v49.76,28.19 48.46,26.9 43.05,26.9 39.55,30.4 31.55,30.4 v29.49,32.46 | v22.33,38.1 22.29,38.14 | v24.08,45.49 23.81,45.76
LRD  (via drill 0.38)
  Top 0.152: v71.63,31.62 71.55,31.7 70.56,31.7 IC5.10 | v31.47,24.99 31.47,25.98 29.95,27.51 v29.95,30.33
  Bottom 0.152: v71.63,31.62 71.17,31.62 67.89,28.35 66.75,28.35 59.21,20.8 59.21,20.19 53.65,14.63 39.32,14.63 33.53,20.42 33.53,23.32 32.77,24.08 32.38,24.08 v31.47,24.99 | v29.95,30.33 29.95,31.09 28.8,32.23 28.8,33.76 30.33,35.28 30.33,51.66 31.55,52.88 31.55,57.68 29.87,59.36 29.18,59.36 X1.11
LRESET  (via drill 0.38)
  Top 0.152: v53.8,34.06 60.73,34.06 61.04,33.76 62.79,33.76 IC5.26 | v31.01,51.44 31.01,51.82 29.72,53.11 29.72,60.66 v30.4,61.34
  Bottom 0.152: v53.8,34.06 51.21,34.06 50.52,34.75 50.06,34.75 48.31,32.99 38.86,32.99 35.2,36.65 33.91,36.65 31.01,39.55 v31.01,51.44 | v30.4,61.34 29.26,61.34 29.18,61.42 X1.7
LTS+
  Top 0.152: K1.O2 95.25,26.44 93.04,24.23 93.04,18.21 88.92,14.1 88.92,2.13 X6.1
LTS-
  Top 0.152: X6.2 93.5,5.41 93.5,11.28 101.12,18.9 101.12,26.14 102.87,27.89 K1.O1
LVSEL
  Top 0.152: IC5.14 70.56,34.37 76.5,34.37 79.55,37.41 80.01,37.41 IC1.11
LWR  (via drill 0.38)
  Top 0.152: v71.63,30.63 71.17,31.09 70.56,31.09 IC5.9 | v60.05,20.73 59.13,20.73 58.75,21.11 46.63,21.11 v43.36,24.38 | v29.03,28.96 28.5,28.96 28.19,28.65 25.6,28.65 25.3,28.96 17.98,28.96 17.75,28.73 17.75,27.13 17.53,26.9 16.08,26.9 15.24,27.74 15.24,28.73 11.35,32.61 11.35,34.52 v10.9,34.98 | v5.56,40.31 v8.23,37.64 | v3.12,43.66 2.59,43.13 2.59,39.93 2.67,39.85 2.67,39.4 2.21,38.94 1.75,38.94 1.29,39.4 1.29,63.17 4.27,66.14 26.98,66.14 31.39,61.72 31.39,60.12 v30.71,59.44
  Bottom 0.152: v71.63,30.63 70.64,30.63 68.05,28.04 66.9,28.04 60.05,21.18 v60.05,20.73 | v43.36,24.38 43.36,24.77 41.6,26.52 36.73,26.52 34.29,28.96 v29.03,28.96 | v8.23,37.64 v10.9,34.98 | v5.56,40.31 5.56,41.22 v3.12,43.66 | v30.71,59.44 30.33,59.44 29.87,59.89 29.18,59.89 X1.10
N$1  (via drill 0.38)
  Top 0.152: v97.92,42.75 97.54,43.13 97.54,47.24 95.94,48.84 95.94,49.53 R1.1 | v86.87,30.94 87.33,30.94 89.08,29.18 91.21,29.18 91.36,29.03 91.36,28.12 90.6,27.36 90.14,27.36 IC1.2
  Bottom 0.152: v97.92,42.75 97.92,42.29 86.87,31.24 v86.87,30.94
N$2
  Top 0.152: R2.1 102.18,35.51 102.03,35.51 97.69,31.17 90.14,31.17 IC1.5
N$3
  Top 0.152: IC1.6 90.53,32.38 93.65,35.51 95.86,35.51 R3.1
N$4
  Top 0.152: R4.1 92.43,38.1 90.53,36.2 IC1.9
N$5  (via drill 0.38)
  Top 0.152: v91.67,30.48 97.46,30.48 101.04,34.06 103.78,34.06 110.34,40.62 112.32,40.62 R5.1 | v83.74,31.62 83.74,32.92 80.47,36.2 IC1.12
  Bottom 0.152: v91.67,30.48 87.33,30.48 87.1,30.25 85.11,30.25 v83.74,31.62
N$6
  Top 0.152: T8.1 99.75,63.32 104.39,63.32 107.9,59.82 L3.2 107.97,59.82 109.12,60.96 SG1.-
N$7  (via drill 0.38)
  Top 0.152: v107.97,45.41 108.89,45.41 T4.3 | v97.99,38.86 97.23,38.1 R4.2
  Bottom 0.152: v107.97,45.41 106.83,45.41 100.28,38.86 v97.99,38.86
N$8
  Top 0.152: T5.3 114,39.17 114,40.31 113.69,40.62 R5.2
N$9
  Top 0.152: 123.14,28.5 123.14,30.48 121.92,31.7 H1.4 | 123.14,28.5 123.14,27.96 D2.A | 123.14,28.5 120.17,28.5 118.26,26.59 110.87,26.59 105.46,21.18 105.46,19.05 F1.P$1
N$10
  Top 0.152: R7.1 95.56,53.34 T1.1
N$11  (via drill 0.38)
  Top 0.152: v103.02,45.57 103.02,44.04 101.96,42.98 101.58,42.98 T2.1 | v107.59,54.25 109.96,56.62 121.84,56.62 122.3,56.16 122.3,55.09 121.54,54.33 119.86,54.33 118.11,52.58 118.11,50.14 R8.1
  Bottom 0.152: v103.02,45.57 103.02,49.68 v107.59,54.25
N$12
  Top 0.152: T3.1 120.62,53.57 120.24,53.57 118.8,52.12 R9.1
N$13
  Top 0.152: T1.3 97.54,49.84 97.23,49.53 R1.2
N$14
  Top 0.152: T2.3 100.66,40.84 100.66,39.85 101.58,38.94 101.58,36.2 100.97,35.59 R2.2
N$15  (via drill 0.38)
  Top 0.152: T3.3 120.93,55.63 120.24,56.31 112.39,56.31 111.25,55.17 111.25,53.49 110.64,52.88 v109.35,52.88 | v99.44,40.31 99.44,39.85 99.14,39.55 99.14,37.49 97.23,35.59 R3.2
  Bottom 0.152: v109.35,52.88 109.35,49.99 107.14,47.78 107.14,46.48 100.97,40.31 v99.44,40.31
N$16
  Top 0.152: T4.1 109.65,43.43 111.25,45.03 111.25,45.64 113.84,48.23 117.5,48.23 118.72,47.02 R10.1
N$17
  Top 0.152: R7.2 102.26,51.05 102.49,50.83 C1.2 102.56,50.75 109.88,50.75 111.33,49.3 111.33,48.84 111.48,48.69 120.02,48.69 | 120.02,49.53 120.02,52.05 R9.2 | 120.02,49.53 120.02,48.69 | 120.02,48.69 120.02,47.02 R10.2 120.02,46.94 120.02,44.5 R11.2 120.09,44.42 121.23,43.28 121.23,41.99 IC7.7 | 120.02,49.53 R8.2
N$18  (via drill 0.38)
  Top 0.152: 100.66,49.76 100.66,50.75 C1.1 | 100.66,49.76 100.66,47.02 C5.1 | 120.74,37.99 120.02,37.26 120.02,36.88 | 120.74,37.99 120.85,38.1 124.28,38.1 125.27,37.11 125.27,28.96 123.67,27.36 122.68,27.36 122.15,27.89 120.7,27.89 D2.C 120.62,27.89 119.02,26.29 111.02,26.29 106.45,21.72 106.45,18.36 105.46,17.37 105.46,8.91 F1.P$2 | 120.02,36.88 IC7.1 120.02,36.8 | 120.74,37.99 120.7,38.02 120.7,43.05 120.4,43.36 119.86,43.36 118.8,44.42 R11.1 118.72,44.5 v117.96,45.26 | 120.02,36.88 117.81,36.88 C6.1 | 100.66,49.76 105.08,49.76 105.31,49.99 106.07,49.99 110.57,45.49 v110.57,45.26
  Bottom 0.152: v117.96,45.26 v110.57,45.26
N$19
  Top 0.152: H2.4 5.11,31.7 5.11,27.96 D1.A 5.03,27.89 2.59,25.45 2.59,19.05 F2.P$1
N$20  (via drill 0.38)
  Top 0.152: v33.45,31.09 33.22,31.32 28.35,31.32 25.6,34.06 22.33,34.06 19.66,36.73 15.54,36.73 14.86,37.41 14.86,39.01 13.41,40.46 13.41,41.91 R15.1 | v48.23,27.58 48.69,27.58 49.07,27.2 51.89,27.2 51.97,27.28 IC2.2
  Bottom 0.152: v33.45,31.09 44.73,31.09 v48.23,27.58
N$21
  Top 0.152: R13.2 112.39,33.07 113.61,33.07 114.53,33.98 H1.1
N$22
  Top 0.152: T8.3 94.94,57.45 94.94,60.05 95.86,60.96 R14.2
N$23
  Top 0.152: S8.1 42.52,18.44 42.52,15.24 R35.1
N$24  (via drill 0.38)
  Top 0.152: v31.7,37.11 31.7,38.02 30.33,39.4 23.24,39.4 18.21,44.42 18.21,49.61 17.07,50.75 13.41,50.75 R16.1 | v48.39,31.7 50.22,31.7 50.75,31.17 51.97,31.17 IC2.5
  Bottom 0.152: v31.7,37.11 32.46,37.11 37.87,31.7 v48.39,31.7
N$25  (via drill 0.38)
  Top 0.152: v8.23,43.43 7.62,44.04 7.62,46.25 7.47,46.41 7.16,46.41 5.87,47.7 5.87,48.69 6.93,49.76 6.93,50.75 R17.1 | v19.43,36.04 v15.39,36.04 | v42.14,25.07 47.55,25.07 v48.39,25.91 | v50.44,32.69 51.66,32.69 51.97,32.38 IC2.6
  Bottom 0.152: v8.23,43.43 8.23,43.2 v15.39,36.04 | v19.43,36.04 23.77,36.04 26.82,32.99 26.82,28.12 28.96,25.98 41.22,25.98 v42.14,25.07 | v48.39,25.91 51.13,28.65 51.13,32 v50.44,32.69
N$26  (via drill 0.38)
  Top 0.152: v34.14,31.77 28.35,31.77 25.76,34.37 22.48,34.37 19.81,37.03 15.7,37.03 15.16,37.57 15.16,43.2 14.25,44.12 13.79,44.12 13.03,44.88 13.03,45.87 13.95,46.79 13.95,47.55 R18.1 | v45.72,31.01 45.72,32.99 45.26,33.45 45.26,34.82 v46.86,36.42 | v50.44,36.42 51.74,36.42 51.97,36.2 IC2.9
  Bottom 0.152: v34.14,31.77 37.34,31.77 37.72,31.39 45.34,31.39 v45.72,31.01 | v50.44,36.42 v46.86,36.42
N$27  (via drill 0.38)
  Top 0.152: v13.56,65 12.12,63.55 R19.1 | v37.8,39.24 40.84,36.2 IC2.12
  Bottom 0.152: v13.56,65 29.95,65 35.28,59.66 35.28,40.54 35.89,39.93 37.11,39.93 v37.8,39.24
N$28
  Bottom 0.152: T13.3 22.48,48.62 22.48,47.78 20.42,45.72 19.36,45.72 18.44,44.81 18.44,42.98 19.2,42.22 20.57,42.22 22.17,40.62 22.17,39.4 R44.2
N$29
  Top 0.152: R15.2 12.19,41.91 13.72,43.43 T6.3
N$30
  Top 0.152: T7.3 12.12,50.75 R16.2
N$31
  Top 0.152: T9.3 8.61,51.13 8.31,50.83 R17.2
N$32  (via drill 0.38)
  Top 0.152: v13.72,52.88 13.72,55.63 T10.3 | v13.18,49.76 14.02,48.92 R18.2
  Bottom 0.152: v13.72,52.88 14.94,51.66 14.94,51.21 13.49,49.76 v13.18,49.76
N$33
  Top 0.152: T11.3 13.64,60.73 13.64,63.25 13.41,63.48 R19.2
N$34  (via drill 0.38)
  Top 0.152: 43.66,5.18 43.66,4.5 42.98,3.81 42.29,3.81 41.15,4.95 41.15,6.63 33.83,13.95 25.45,13.95 24.16,15.24 K2.16 | 43.66,5.18 43.66,13.49 43.13,14.02 42.52,14.02 41.3,15.24 R35.2 | K1.16 95.25,13.49 90.45,8.69 90.45,1.68 89.92,1.14 45.26,1.14 v43.89,2.52 | 43.66,5.18 v43.89,5.18
  Bottom 0.152: v43.89,5.18 v43.89,2.52
N$35
  Top 0.152: T6.1 11.66,44.42 11.66,42.67 9.6,40.62 9.6,39.4 R22.1
N$36  (via drill 0.38)
  Top 0.152: v7.24,47.24 6.63,47.85 6.63,48.23 T7.1 | v9.6,45.49 9.6,41.91 R23.1
  Bottom 0.152: v7.24,47.24 7.85,47.24 v9.6,45.49
N$37
  Top 0.152: T9.1 7.62,53.57 7.62,47.78 7.92,47.47 7.92,46.02 8.23,45.72 R24.1
N$38
  Top 0.152: T10.1 12.72,50.22 R25.1
N$39
  Top 0.152: C2.2 13.64,36.88 13.41,37.11 13.41,39.32 R26.2 13.34,39.4 13.18,39.4 12.5,40.08 11.43,40.08 9.98,38.63 8.99,38.63 8.31,39.32 R22.2 8.23,39.4 R23.2 | 8.23,42.52 7.05,43.7 | 7.05,43.7 7.01,43.74 7.01,45.72 R24.2 | R23.2 8.23,42.52 | R23.2 | 8.23,42.52 8.91,43.2 8.91,45.72 10.74,47.55 11.43,47.55 R25.2 | IC8.7 4.5,41.99 4.5,42.52 5.64,43.66 7.01,43.66 7.05,43.7
N$40
  Top 0.152: 8.95,29.45 9.98,30.48 9.98,35.05 10.02,35.09 | 8.95,29.45 7.62,28.12 7.62,27.96 D1.C 7.54,27.89 4.8,25.15 4.8,19.58 2.59,17.37 2.59,8.91 F2.P$2 | 10.02,35.09 11.73,36.8 C2.1 | R26.1 12.04,39.32 12.04,37.11 11.81,36.88 C2.1 | 8.95,29.45 12.57,25.83 16.92,25.83 18.67,27.58 18.67,27.89 C8.1 | C7.1 18.36,33.38 17.98,33.38 16.54,34.82 13.79,34.82 11.81,36.8 C2.1 | IC8.1 3.2,36.73 3.2,36.27 4.34,35.13 9.98,35.13 10.02,35.09
N$41
  Bottom 0.152: T12.1 22.86,50.44 23.47,50.44 25.07,52.05 25.38,52.05 R37.1
N$42
  Top 0.152: R21.2 13.26,27.96 13.26,28.57 12.42,29.41 H2.1
N$43  (via drill 0.38)
  Top 0.152: v19.28,44.73 19.28,46.33 v19.2,46.41
  Bottom 0.152: v19.28,44.73 19.13,44.58 19.13,43.59 T15.1 | v19.2,46.41 17.14,46.41 16.54,45.8 R38.1
N$44
  Bottom 0.152: T14.1 22.86,40.92 25.07,40.92 25.38,41.22 R39.1
N$45
  Top 0.152: IC7.4 123.83,36.27 122.99,35.43 115.52,35.43 113.92,37.03 113.08,37.03 T5.1
N$46
  Bottom 0.152: T13.1 23.47,46.56 21.79,46.56 20.34,45.11 R40.1
N$47
  Top 0.152: T11.1 10.44,58.67 7.32,55.55 7.32,54.48 6.17,53.34 6.17,49.45 5.56,48.84 5.56,44.88 3.89,43.2 3.89,40.39 6.93,37.34 6.93,36.8 IC8.4
N$48
  Bottom 0.152: T14.3 21.87,44.12 22.17,44.42 R43.2
N$49
  Bottom 0.152: T12.3 21.87,52.5 22.02,52.5 23.47,53.95 R41.2
N$50
  Bottom 0.152: T15.3 19.28,41.53 18.29,42.52 16.54,42.52 R42.2
RHVTRIG  (via drill 0.38)
  Top 0.152: v15.54,26.52 14.63,27.43 14.63,27.89 R21.1 | v26.98,24.99 v17.07,24.99 | v32.84,20.65 v30.63,20.65 | v60.58,14.17 61.8,12.95 65.68,12.95 72.47,19.74 72.47,25.68 71.02,27.13 70.56,27.13 IC5.3
  Bottom 0.152: v17.07,24.99 v15.54,26.52 | v26.98,24.99 26.98,24.38 30.63,20.73 v30.63,20.65 | v32.84,20.65 39.32,14.17 v60.58,14.17
RTS+  (via drill 0.38)
  Top 0.152: v34.21,16 33.98,16 v28.35,21.64
  Bottom 0.152: X7.1 38.1,11.66 34.21,15.54 v34.21,16 | v28.35,21.64 28.35,22.1 24.16,26.29 24.16,27.89 K2.O2
RTS-
  Top 0.152: X7.2 42.6,5.41 42.6,8.23 37.11,13.72 37.11,16.84 33.53,20.42 33.53,26.14 31.77,27.89 K2.O1
RVSEL  (via drill 0.38)
  Top 0.152: v55.7,37.03 58.37,34.37 62.79,34.37 IC5.25 | v43.59,37.11 42.29,37.11 41.99,37.41 IC2.11
  Bottom 0.152: v55.7,37.03 50.75,37.03 50.67,37.11 v43.59,37.11
SCL
  Top 0.152: 76.77,7.58 76.73,7.62 76.73,9.3 X9.2 | 76.77,7.58 77.8,6.55 78.41,6.55 79.55,7.7 79.55,8.76 80.47,9.68 80.47,23.7 78.79,25.38 78.79,31.09 76.2,33.68 70.56,33.68 IC5.13 | X8.2 48.16,9.3 48.16,7.92 50.67,5.41 60.73,5.41 61.42,4.72 73,4.72 75.82,7.54 76.73,7.54 76.77,7.58
SDA  (via drill 0.38)
  Top 0.152: 77.65,12.42 77.65,9.53 77.5,9.37 X9.3 | 77.65,12.42 77.65,31.77 76.43,32.99 70.56,32.99 IC5.12 | v49.38,11.51 48.92,11.05 48.92,9.37 X8.3 | 77.65,12.42 v59.89,12.42
  Bottom 0.152: v49.38,11.51 58.98,11.51 v59.89,12.42
SPKR  (via drill 0.38)
  Top 0.152: v95.4,62.03 94.64,61.27 94.64,60.96 R14.1 | v72.62,31.55 71.78,32.38 70.56,32.38 IC5.11
  Bottom 0.152: v95.4,62.03 95.4,49.38 97.46,47.32 97.46,44.04 85.72,32.31 82.98,32.31 81.92,31.24 72.92,31.24 v72.62,31.55
TCK  (via drill 0.38)
  Top 0.152: v35.66,26.67 36.2,26.14 36.2,25.45 R32.1 | v24.23,40.23 22.86,40.23 18.52,44.58 18.52,49.76 16.84,51.44 v14.25,51.44 | v63.93,24.16 63.93,27.13 63.25,27.81 62.87,27.81 IC5.35 | v61.27,8.53 61.27,7.7 62.56,6.4 C18.1 62.26,6.63 v61.34,5.71 | v99.21,34.44 96.62,31.85 v93.8,31.85 | v26.82,25.98 v28.35,27.51
  Bottom 0.152: v35.66,26.67 34.21,26.67 33.83,26.29 30.1,26.29 28.61,27.77 | 28.61,27.77 27.13,29.26 27.13,34.21 24.23,37.11 v24.23,40.23 | v14.25,51.44 10.74,51.44 3.81,58.37 SV1.3 | v63.93,24.16 63.93,17.6 61.57,15.24 61.57,14.63 | 61.57,14.63 61.57,8.84 v61.27,8.53 | S5.2 107.9,38.18 104.24,34.52 99.29,34.52 v99.21,34.44 | v93.8,31.85 93.8,29.41 80.01,15.62 80.01,15.24 79.4,14.63 61.57,14.63 | v28.35,27.51 28.61,27.77 | v26.82,25.98 26.82,25.76 26.29,25.22 26.29,24.61 29.95,20.95 29.95,11.28 32.16,9.07 32.16,6.1 37.11,1.14 56.77,1.14 v61.34,5.71
TDI  (via drill 0.38)
  Top 0.152: SV1.5 5.56,55.09 5.56,55.7 R34.1 | v55.4,26.52 62.79,26.52 IC5.37 62.87,26.52 63.25,26.52 63.63,26.14 63.63,25.68 63.25,25.3 63.25,23.93 63.66,23.51 | v109.42,26.9 112.17,26.9 113.16,27.89 113.31,27.89 C20.1 | v97,28.8 96.62,28.8 96.47,28.96 93.5,28.96 91.29,26.75 87.1,26.75 v85.95,27.89 | v66.06,25.38 64.16,23.47 63.7,23.47 63.66,23.51 | v15.77,29.11 v12.34,32.54 | v28.8,13.26 34.06,13.26 40.46,6.86 v40.46,5.03 | v61.34,6.71 61.34,7.16 60.58,7.92 v60.58,9.22 | 63.66,23.51 v63.25,23.09
  Bottom 0.152: v55.4,26.52 51.82,22.94 S7.2 | v109.42,26.9 106.15,26.9 105.54,27.51 104.62,27.51 104.01,26.9 98.91,26.9 v97,28.8 | v85.95,27.89 83.74,27.89 83.67,27.96 73.46,27.96 72.69,27.2 72.69,26.82 71.25,25.38 v66.06,25.38 | SV1.5 3.81,53.03 6.55,50.29 6.55,36.65 10.67,32.54 v12.34,32.54 | v15.77,29.11 15.77,28.57 28.8,15.54 v28.8,13.26 | v40.46,5.03 43.89,1.6 56.31,1.6 61.34,6.63 v61.34,6.71 | v60.58,9.22 60.58,13.26 61.27,13.95 61.27,21.11 v63.25,23.09
TDO  (via drill 0.38)
  Top 0.152: v94.49,26.59 90.72,22.82 | 90.72,22.82 89.53,21.64 R36.1 | v105.31,26.82 106.38,27.89 C21.1 | v59.36,25.83 62.79,25.83 IC5.38 | v19.13,24.31 32.16,24.31 v32.61,24.77 | 90.72,22.82 87.86,25.68 85.8,25.68 84.89,26.59 83.21,26.59 81.69,28.12 v81.69,31.93
  Bottom 0.152: v94.49,26.59 105.08,26.59 v105.31,26.82 | SV1.6 3.81,50.44 1.29,47.93 1.29,39.4 16.38,24.31 v19.13,24.31 | v32.61,24.77 36.8,20.57 36.8,19.05 S8.3 36.88,19.05 39.32,16.61 44.73,16.61 46.33,18.21 52.12,18.21 59.36,25.45 v59.36,25.83 62.64,29.11 68.2,29.11 71.4,32.31 72.77,32.31 73.15,31.93 v81.69,31.93
TEST  (via drill 0.38)
  Top 0.152: v81.84,20.34 86.26,15.93 89.53,15.93 R20.1 | v69.27,24.23 69.27,24.61 70.48,25.83 IC5.1 | v16.38,52.27 16.92,51.74 16.99,51.74 19.66,49.07 19.66,46.86 22.17,44.35 22.17,41.99 23.24,40.92 24.46,40.92 v25.22,40.16 | v29.03,34.9 36.5,34.9 41,30.4 43.13,30.4 46.94,26.59 53.19,26.59 v57.53,22.25 | v57.53,20.42 61.49,16.46 v63.7,16.46
  Bottom 0.152: v81.84,20.34 73.91,20.34 73.38,20.88 70.41,20.88 69,22.29 | 69,22.29 68.89,22.4 68.89,23.85 v69.27,24.23 | v16.38,52.27 5.18,63.48 3.81,63.48 SV1.1 | v25.22,40.16 25.22,39.09 25.07,38.94 25.07,38.48 27.51,36.04 27.89,36.04 v29.03,34.9 | v57.53,20.42 v57.53,22.25 | v63.7,16.46 63.7,16.92 68.28,21.49 68.28,21.57 69,22.29
TMS  (via drill 0.38)
  Top 0.152: v61.65,27.2 62.79,27.2 IC5.36 | v53.11,15.54 49.76,12.19 47.09,12.19 46.63,11.73 46.63,7.85 47.05,7.43 | 47.05,7.43 49.38,5.11 59.97,5.11 62.48,2.59 C19.1 | R33.1 7.62,62.87 5.41,62.87 4.5,61.95 2.59,61.95 2.06,61.42 2.06,57.68 3.81,55.93 SV1.4 3.81,55.85 1.6,53.65 1.6,47.55 1.98,47.17 v1.98,39.62 | v25.6,36.65 24.77,36.65 22.63,38.79 20.73,38.79 S6.2 | v16.99,30.48 v27.81,30.48 | 47.05,7.43 43.13,3.5 37.49,3.5 30.18,10.82 v29.49,10.82
  Bottom 0.152: v61.65,27.2 57.38,22.94 57.3,22.94 53.11,18.75 v53.11,15.54 | v25.6,36.65 25.6,36.2 27.43,34.37 27.43,30.86 v27.81,30.48 | v1.98,39.62 11.12,30.48 v16.99,30.48 16.99,27.81 29.49,15.32 v29.49,10.82
VBAT
  Top 0.152: 95.97,41.34 97.16,40.16 97.61,40.16 101.19,43.74 101.5,43.74 102.18,44.42 R46.2 | 95.97,41.34 95.94,41.38 95.94,41.91 R45.1 | 95.97,41.34 95.02,40.39 52.81,40.39 47.85,35.43 47.85,34.37 50.22,32 50.37,32 50.6,31.77 53.11,31.77 54.1,32.77 57.45,32.77 57.76,32.46 62.79,32.46 IC5.28
VCC  (via drill 0.38)
  Top 0.305: v47.32,11.51 47.32,9.37 X8.1 | C10.1 95.63,64.77 96.7,65.84 104.24,65.84 107.9,62.18 L3.1 108.05,62.26 111.63,62.26 111.78,62.41 117.35,62.41 118.8,60.96 SG1.+ | v116.59,47.55 116.59,44.81 IC3.3 | v76.81,11.73 75.89,10.82 75.89,9.37 X9.1
  Bottom 0.305: 31.7,16.76 31.7,15.24 K2.1 | 31.7,16.76 31.7,20.57 29.87,22.4 29.87,23.93 25.98,27.81 25.98,28.42 24.16,30.25 24.16,32.99 K2.S2 | 31.7,16.76 35.97,16.76 41.22,11.51 v47.32,11.51 47.4,11.43 48.46,11.43 49.91,9.98 58.83,9.98 61.04,7.77 71.17,7.77 75.06,11.66 76.73,11.66 v76.81,11.73 82.75,11.73 93.42,22.4 | SG1.+ 118.8,60.96 116.59,58.75 v116.59,47.55 116.51,47.47 111.78,47.47 99.52,35.2 97.38,35.2 95.33,33.15 K1.S2 95.25,30.25 93.42,28.42 93.42,22.4 | 93.42,22.4 100.58,15.24 K1.1
XIN
  Top 0.152: IC5.6 70.56,29.18 72.77,29.18 73.61,30.02 Q3.2 73.69,30.1 73.91,30.33 73.91,31.7 C12.1
XOUT
  Top 0.152: IC5.5 70.56,28.5 73.53,28.5 73.61,28.42 Q3.1 73.69,28.35 74.98,27.05 76.2,27.05 C11.1
(copper drawn outside any net)
  shapes: Bottom area x5, Top area x5